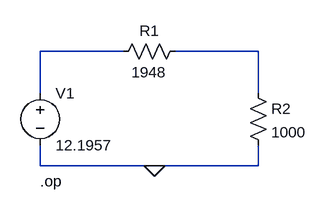
[diagram p0: schematic thevinin 1.asc]
thevinin 1.asc, the LTspice schematic file:
Version 4
SHEET 1 880 680
WIRE 176 80 48 80
WIRE 384 80 256 80
WIRE 48 144 48 80
WIRE 384 144 384 80
WIRE 48 256 48 224
WIRE 224 256 48 256
WIRE 384 256 384 224
WIRE 384 256 224 256
FLAG 224 256 0
SYMBOL voltage 48 128 R0
SYMATTR InstName V1
SYMATTR Value 12.1957
SYMBOL res 160 96 R270
WINDOW 0 32 56 VTop 2
WINDOW 3 0 56 VBottom 2
SYMATTR InstName R1
SYMATTR Value 1948
SYMBOL res 368 128 R0
SYMATTR InstName R2
SYMATTR Value 1000
TEXT 48 280 Left 2 !.op

The netlist it stands for:
* thevinin 1.asc
V1 N001 0 12.1957
R1 N001 N002 1948
R2 N002 0 1000
.op
.backanno
.end